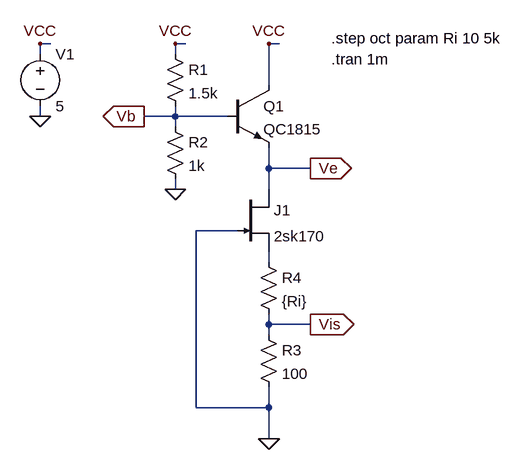
[diagram p0: schematic Vbe_Check_JFET.asc]
Vbe_Check_JFET.asc, the LTspice schematic file:
Version 4
SHEET 1 880 680
WIRE -80 -32 -96 -32
WIRE 128 -32 112 -32
WIRE 272 -32 256 -32
WIRE -96 -16 -96 -32
WIRE 112 -16 112 -32
WIRE 256 32 256 -32
WIRE -96 80 -96 64
WIRE 112 80 112 64
WIRE 112 80 64 80
WIRE 192 80 112 80
WIRE 112 96 112 80
WIRE 256 160 256 128
WIRE 320 160 256 160
WIRE 112 192 112 176
WIRE 256 192 256 160
WIRE 208 256 144 256
WIRE 256 304 256 288
WIRE 256 400 256 384
WIRE 320 400 256 400
WIRE 256 416 256 400
WIRE 144 528 144 256
WIRE 256 528 256 496
WIRE 256 528 144 528
WIRE 256 576 256 528
FLAG 256 576 0
FLAG 256 -32 VCC
FLAG 112 -32 VCC
FLAG 112 192 0
FLAG -96 80 0
FLAG -96 -32 VCC
FLAG 64 80 Vb
IOPIN 64 80 Out
FLAG 320 160 Ve
IOPIN 320 160 Out
FLAG 320 400 Vis
IOPIN 320 400 Out
SYMBOL npn 192 32 R0
SYMATTR InstName Q1
SYMATTR Value QC1815
SYMBOL res 96 -32 R0
SYMATTR InstName R1
SYMATTR Value 1.5k
SYMBOL res 96 80 R0
SYMATTR InstName R2
SYMATTR Value 1k
SYMBOL voltage -96 -32 R0
WINDOW 123 0 0 Left 2
WINDOW 39 0 0 Left 2
SYMATTR InstName V1
SYMATTR Value 5
SYMBOL njf 208 192 R0
SYMATTR InstName J1
SYMATTR Value 2sk170
SYMBOL res 240 288 R0
SYMATTR InstName R4
SYMATTR Value {Ri}
SYMBOL res 240 400 R0
SYMATTR InstName R3
SYMATTR Value 100
TEXT 352 -8 Left 2 !.tran 1m
TEXT 352 -40 Left 2 !.step oct param Ri 10 5k

The netlist it stands for:
* Vbe_Check_JFET.asc
Q1 VCC Vb Ve 0 QC1815
R1 VCC Vb 1.5k
R2 Vb 0 1k
V1 VCC 0 5
J1 Ve 0 N001 2sk170
R4 N001 Vis {Ri}
R3 Vis 0 100
.model NPN NPN
.model PNP PNP
.lib standard.bjt
.model NJF NJF
.model PJF PJF
.lib standard.jft
.tran 1m
.step oct param Ri 10 5k
.backanno
.end